# EAGLE design FAJAS_EDCPSU_USBC (EAGLE 9.6.2)
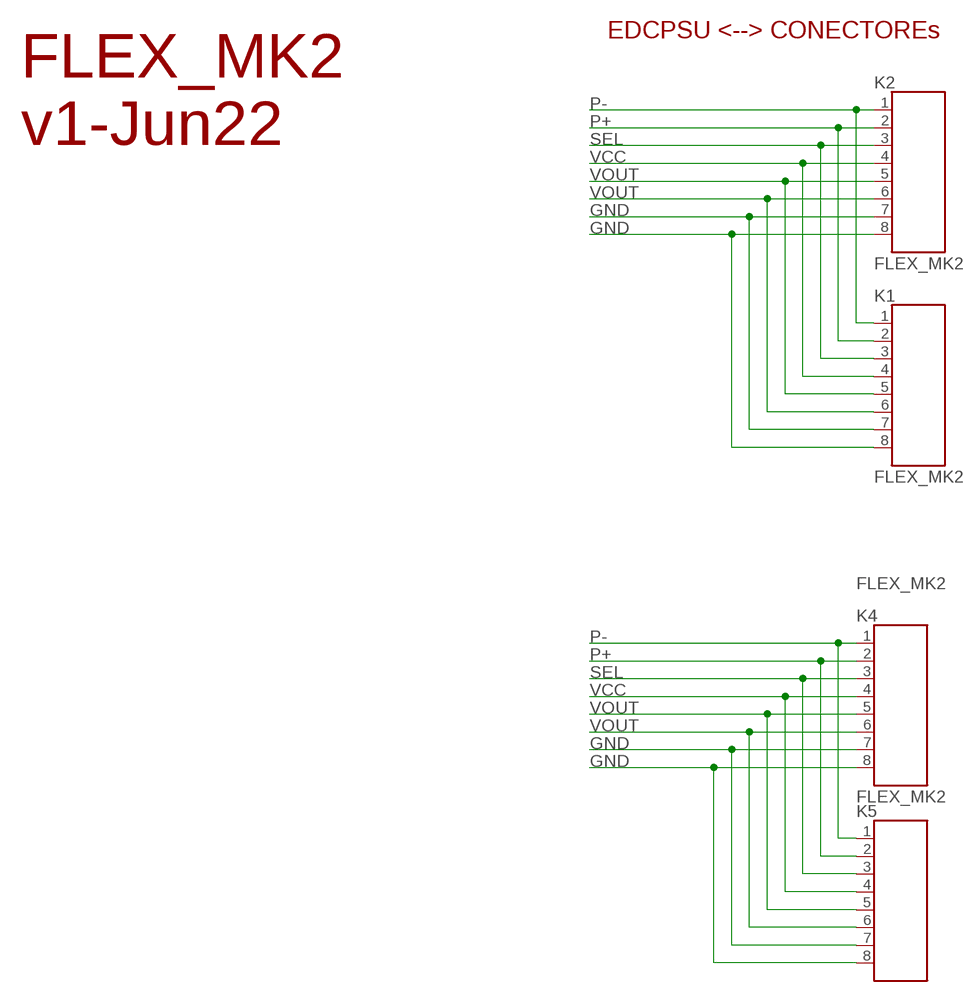
[diagram p0: schematic, sheet 1]

## Parts
K1  FLEX_MK2  FLEX8  [FLEX8]
K2  FLEX_MK2  FLEX8  [FLEX8]
K4  FLEX_MK2  FLEX8  [FLEX8]
K5  FLEX_MK2  FLEX8  [FLEX8]

## Nets
GND: K1.7 K1.8 K2.7 K2.8 K4.7 K4.8 K5.7 K5.8
P+: K1.2 K2.2 K4.2 K5.2
P-: K1.1 K2.1 K4.1 K5.1
SEL: K1.3 K2.3 K4.3 K5.3
VCC: K1.4 K2.4 K4.4 K5.4
VOUT: K1.5 K1.6 K2.5 K2.6 K4.5 K4.6 K5.5 K5.6

## Notes on the sheet
- EDCPSU <--> CONECTOREs
- FLEX_MK2
  v1-Jun22

## Library data of the parts
K1 K2 K4 K5 = Flex_Faja_connector:FLEX8: WR-FPC 1mm SMT Horiz. Bot. Contact Hinge type WR-FPC 1mm 08 pins Hinge type SMT Horizontal Bottom Contact ;=>Code : Con_FPC_ZIF_1.00_6861xx148922_686108148922 <http://katalog.we-online.de/media/images/eican/Con_FPC_ZIF_1.00_686110148922_pf2.jpg> Details see: http://katalog.we-online.de/em/datasheet/6861xx148922.pdf Created 2014-10-08, Karrer Zheng 2014 (C) Wurth Elektronik

## Net classes
1 power: width 0.178 mm
2 gnd: width 0.305 mm, drill 0.483 mm, clearance 0.203 mm

## Board
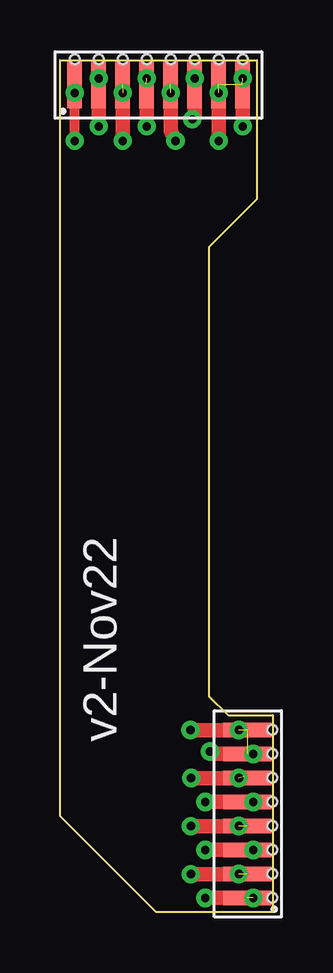
[diagram p1: board, top side]
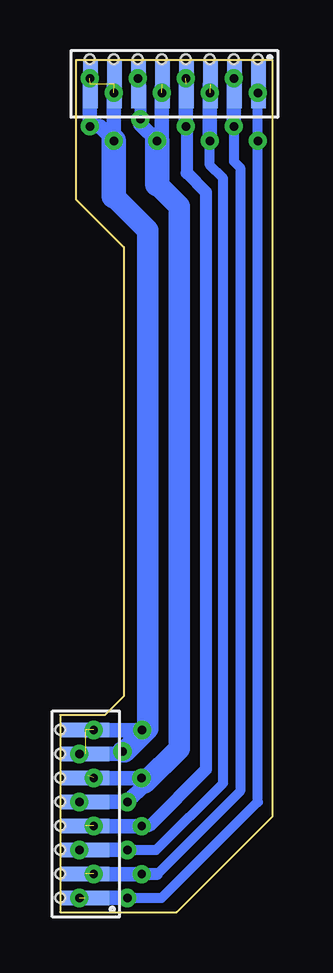
[diagram p2: board, bottom side, seen from below]

Size 8.86 x 35.5 mm. Coordinates in mm from the lower left corner, seen from the top.
Outline: 0,35.5 8.2,35.5 8.2,29.7 6.2,27.7 6.2,9 7,8.2 8.86,8.2 8.86,0 4,0 0,4 0,35.5
Copper layers (1*16): Top 0.035mm / dielectric 1.5mm / Bottom 0.035mm
Design rules "default *": minimum track width 6mil, minimum drill 0.25mm, track to track 0.2mm, track to pad 0.2mm, pad to pad 0.2mm, via to via 0.2mm, smd to smd 0mil, copper to edge 0mil, drill to drill 6mil, minimum pad ring 10mil, minimum via ring 8mil, stop-mask expansion 4mil, vias tented up to drill 50mil, thermal gap 10mil
Holes 0.4 mm at 7.61,35.53 6.61,35.53 5.61,35.53 4.61,35.53 3.61,35.53 2.61,35.53 1.61,35.53 0.61,35.53 8.85,4.59 8.85,5.59 8.85,6.59 8.85,7.59 8.85,0.59 8.85,1.59 8.85,2.59 8.85,3.59

### Footprints (pad centres in the part's own frame; a part is rotated, then mirrored left to right if it is on the bottom)
FLEX8 = smd 0.6 x 2: 1 -3.5,0.25; 2 -2.5,0.25; 3 -1.5,0.25; 4 -0.5,0.25; 5 0.5,0.25; 6 1.5,0.25; 7 2.5,0.25; 8 3.5,0.25

### Placement (x,y rotation side)
K1  4.09,34.73 180 bottom
K2  4.1,34.23 0 top
K4  8.05,4.09 90 top
K5  7.55,4.09 90 bottom

### Tracks (layer width: path | path; a pad name or v marks a point on that pad's centre or on a via)
GND  (via drill 0.35)  (6 unrouted)
  Top 0.254: 6.61,34.47 K2.7 | 7.61,34.47 K2.8
  Top 0.508: 7.62,32.72 v7.61,32.73 | K5.8
  Top 0.61: v6.61,32.13 6.61,34.47 | v7.61,32.73 7.61,34.47 | K5.8 v5.44,7.58 | K5.7 6.35,6.59 v6.25,6.68
  Bottom 0.254: K2.7 K1.7 | 7.63,32.71 v7.61,32.73 7.59,32.76
  Bottom 0.406: 6.61,34.46 K2.7 | 7.61,34.46 K1.8
  Bottom 0.61: v6.61,32.13 6.61,34.46 | 7.61,34.46 v7.61,32.73 7.21,32.73 v6.61,32.13 | v5.44,7.58 K5.8 | v8.05,6.59 6.35,6.59 v6.25,6.68
  Bottom 0.9: v6.25,6.68 6.15,6.68 5.2,7.64 5.2,28.41 6.61,29.83
  Bottom 1.016: 6.61,29.83 v6.61,32.13
  other vias: 6.61,34.13 7.61,34.73 7.45,7.59
P+  (via drill 0.35)  (2 unrouted)
  Top 0.254: 1.61,34.47 K2.2
  Top 0.61: v1.61,32.73 1.61,34.47 | K5.2 7.79,1.58 v5.45,1.58
  Bottom 0.406: v1.61,32.73 1.61,31.27 1.36,31.01 1.36,5.03 4.81,1.58
  Bottom 0.508: 4.81,1.58 v5.45,1.58
  Bottom 0.61: K5.2 7.79,1.58 v5.45,1.58 | v1.61,32.73 v1.61,34.73
  other vias: 7.45,1.59
P-  (via drill 0.35)  (2 unrouted)
  Top 0.254: K5.1
  Top 0.406: v0.61,32.13 v0.61,34.13
  Top 0.61: v6.05,0.59 K5.1
  Bottom 0.254: 0.61,34.46 K1.1
  Bottom 0.406: v6.05,0.59 4.62,0.59 0.61,4.59 v0.61,32.13 0.61,34.46
  Bottom 0.61: v6.05,0.59 K5.1
  other vias: 8.05,0.59
SEL  (via drill 0.35)  (2 unrouted)
  Top 0.254: 2.61,34.47 K2.3 | K5.3 | v6.05,2.58 v6.05,2.59
  Top 0.61: v2.61,32.13 2.61,34.47 | v6.05,2.59 K5.3
  Bottom 0.254: v2.62,32.13 v2.61,32.13 | 2.61,34.46 K1.3
  Bottom 0.406: v6.05,2.59 4.85,2.59 2.06,5.37 2.06,30.57 2.62,31.12 v2.62,32.13
  Bottom 0.61: v6.05,2.59 v8.05,2.59 | v2.61,32.13 2.61,34.46
  other vias: 2.61,34.13
VCC  (via drill 0.35)  (2 unrouted)
  Top 0.254: 3.61,34.47 K2.4
  Top 0.61: v3.61,32.73 3.61,34.47 | K5.4 7.79,3.58 v5.45,3.58
  Bottom 0.254: 3.61,34.46 K1.4
  Bottom 0.406: 5.15,3.58 v5.45,3.58
  Bottom 0.508: 3.59,32.71 3.59,30.8 2.78,30 2.78,5.94 5.15,3.58
  Bottom 0.61: K5.4 7.79,3.58 v5.45,3.58 | 3.59,32.71 v3.61,32.73 3.61,34.46
  other vias: 3.61,34.73 7.45,3.59
VOUT  (via drill 0.35)  (4 unrouted)
  Top 0.254: 5.61,34.47 K2.6 | 4.61,34.47 K2.5
  Top 0.508: K5.6 7.78,5.57 | K5.5 | v5.51,33.03 5.51,33.01
  Top 0.61: 4.61,34.47 4.61,32.53 v4.81,32.13 | v5.61,34.73 5.61,33.13 v5.51,33.03 | 7.78,5.57 5.48,5.57 v5.46,5.58 | v6.05,4.59 K5.5
  Bottom 0.254: 7.71,5.68 K5.6 | 4.61,34.36 4.59,34.38 K1.5
  Bottom 0.508: K1.6 5.51,34.41 v5.51,33.03
  Bottom 0.61: 4.61,34.36 4.61,32.33 v4.81,32.13 5.51,32.83 v5.51,33.03 | K5.6 7.79,5.57 5.47,5.57 v5.46,5.58 5.33,5.58 5.33,5.38 5.33,5.31 v6.05,4.59 v8.05,4.59
  Bottom 0.9: 4.81,30.32 3.9,29.4 3.9,6.8 5.33,5.38
  Bottom 1.016: v4.81,32.13 4.81,30.32
  other vias: 7.45,5.59 4.61,34.13

### Text on the board
tNames: v2-Nov22